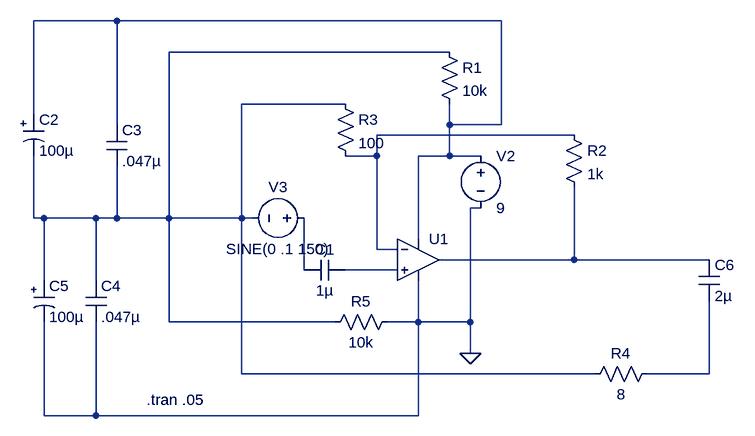
[diagram p0: schematic receiver.asc]
receiver.asc, the LTspice schematic file:
Version 4
SHEET 1 1532 680
WIRE -272 -432 -400 -432
WIRE 320 -432 -272 -432
WIRE 240 -384 -192 -384
WIRE 80 -304 -80 -304
WIRE -400 -288 -400 -432
WIRE -272 -272 -272 -432
WIRE 240 -272 240 -304
WIRE 320 -272 320 -432
WIRE 320 -272 240 -272
WIRE 432 -256 128 -256
WIRE 128 -224 128 -256
WIRE 128 -224 80 -224
WIRE 240 -224 240 -272
WIRE 240 -224 192 -224
WIRE 288 -224 240 -224
WIRE 288 -144 272 -144
WIRE -400 -128 -400 -224
WIRE -384 -128 -400 -128
WIRE -304 -128 -384 -128
WIRE -272 -128 -272 -208
WIRE -272 -128 -304 -128
WIRE -192 -128 -192 -384
WIRE -192 -128 -272 -128
WIRE -80 -128 -80 -304
WIRE -80 -128 -192 -128
WIRE -64 -128 -80 -128
WIRE 192 -96 192 -224
WIRE 128 -80 128 -224
WIRE 160 -80 128 -80
WIRE 432 -64 432 -176
WIRE 432 -64 224 -64
WIRE 640 -64 432 -64
WIRE 16 -48 16 -128
WIRE 160 -48 80 -48
WIRE -384 -32 -384 -128
WIRE -304 -32 -304 -128
WIRE -192 32 -192 -128
WIRE 64 32 -192 32
WIRE 192 32 192 -32
WIRE 192 32 144 32
WIRE 272 32 272 -144
WIRE 272 32 192 32
WIRE 272 80 272 32
WIRE -80 112 -80 -128
WIRE 464 112 -80 112
WIRE 640 112 640 0
WIRE 640 112 544 112
WIRE -384 176 -384 32
WIRE -304 176 -304 32
WIRE -304 176 -384 176
WIRE 192 176 192 32
WIRE 192 176 -304 176
FLAG 272 80 0
SYMBOL Opamps\\UniversalOpamp2 192 -64 R0
SYMATTR InstName U1
SYMBOL voltage 288 -240 R0
WINDOW 123 0 0 Left 2
WINDOW 39 0 0 Left 2
SYMATTR InstName V2
SYMATTR Value 9
SYMBOL voltage 32 -128 R90
WINDOW 0 -32 56 VBottom 2
WINDOW 3 32 56 VTop 2
WINDOW 123 0 0 Left 2
WINDOW 39 0 0 Left 2
SYMATTR InstName V3
SYMATTR Value SINE(0 .1 150)
SYMBOL res 416 -272 R0
SYMATTR InstName R2
SYMATTR Value 1k
SYMBOL res 64 -320 R0
SYMATTR InstName R3
SYMATTR Value 100
SYMBOL res 560 96 R90
WINDOW 0 0 56 VBottom 2
WINDOW 3 32 56 VTop 2
SYMATTR InstName R4
SYMATTR Value 8
SYMBOL cap 80 -64 R90
WINDOW 0 0 32 VBottom 2
WINDOW 3 32 32 VTop 2
SYMATTR InstName C1
SYMATTR Value 1µ
SYMBOL res 224 -400 R0
SYMATTR InstName R1
SYMATTR Value 10k
SYMBOL res 160 16 R90
WINDOW 0 0 56 VBottom 2
WINDOW 3 32 56 VTop 2
SYMATTR InstName R5
SYMATTR Value 10k
SYMBOL polcap -416 -288 R0
WINDOW 3 24 56 Left 2
SYMATTR InstName C2
SYMATTR Value 100µ
SYMATTR Description Capacitor
SYMATTR Type cap
SYMATTR SpiceLine V=25
SYMBOL cap -288 -272 R0
SYMATTR InstName C3
SYMATTR Value .047µ
SYMBOL cap -320 -32 R0
SYMATTR InstName C4
SYMATTR Value .047µ
SYMBOL polcap -400 -32 R0
WINDOW 3 24 56 Left 2
SYMATTR InstName C5
SYMATTR Value 100µ
SYMATTR Description Capacitor
SYMATTR Type cap
SYMATTR SpiceLine V=25
SYMBOL cap 624 -64 R0
SYMATTR InstName C6
SYMATTR Value 2µ
TEXT -226 152 Left 2 !.tran .05

The netlist it stands for:
* receiver.asc
XU1 N006 N003 N001 0 N004 level.2 Avol=1Meg GBW=10Meg Slew=10Meg ilimit=25m rail=0 Vos=0 phimargin=45 en=0 enk=0 in=0 ink=0 Rin=500Meg  ; pins IN+ IN- V+ V- OUT
V2 N001 0 9
V3 N005 N002 SINE(0 .1 150)
R2 N003 N004 1k
R3 N002 N003 100
R4 N007 N002 8
C1 N006 N005 1µ
R1 N002 N001 10k
R5 0 N002 10k
C2 N001 N002 100µ V=25
C3 N001 N002 .047µ
C4 N002 0 .047µ
C5 N002 0 100µ V=25
C6 N004 N007 2µ
.tran .05
.lib UniversalOpamps2.sub
.backanno
.end